# EAGLE design ridicideskaV2 (EAGLE 6.3)

## Sheet 1 of 3: Pro sensory vlhkosti
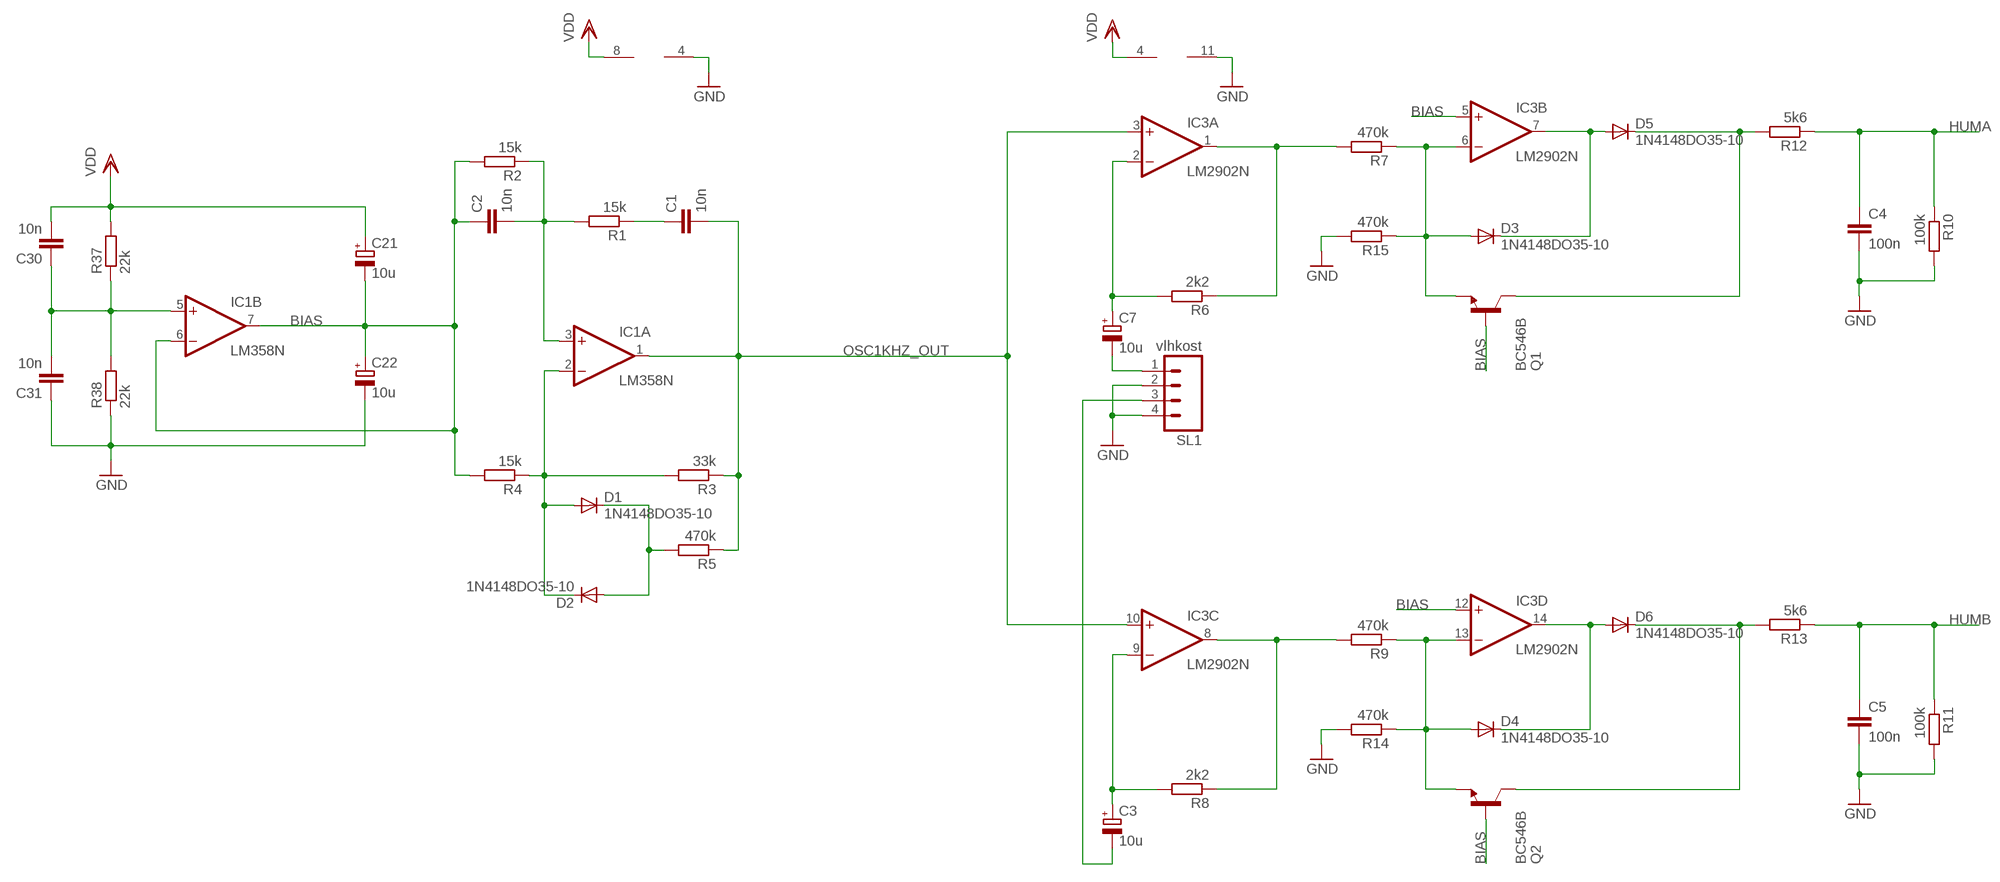
[diagram p0: schematic, sheet 1]

### Parts
C1  10n  C-EUC0805  [C0805]
C2  10n  C-EUC0805  [C0805]
C3  10u  CPOL-EUE3.5-8  [E3,5-8]
C4  100n  C-EUC0805  [C0805]
C5  100n  C-EUC0805  [C0805]
C7  10u  CPOL-EUE3.5-8  [E3,5-8]
C21  10u  CPOL-EUE3.5-8  [E3,5-8]
C22  10u  CPOL-EUE3.5-8  [E3,5-8]
C30  10n  C-EUC0805  [C0805]
C31  10n  C-EUC0805  [C0805]
D1  1N4148DO35-10  [DO35-10]
D2  1N4148DO35-10  [DO35-10]
D3  1N4148DO35-10  [DO35-10]
D4  1N4148DO35-10  [DO35-10]
D5  1N4148DO35-10  [DO35-10]
D6  1N4148DO35-10  [DO35-10]
IC1  LM358N  [DIL08]
IC3  LM2902N  [DIL14]
Q1  BC546B  [TO92-EBC]
Q2  BC546B  [TO92-EBC]
R1  15k  R-EU_R0805  [R0805]
R2  15k  R-EU_R0805  [R0805]
R3  33k  R-EU_R0805  [R0805]
R4  15k  R-EU_R0805  [R0805]
R5  470k  R-EU_R0805  [R0805]
R6  2k2  R-EU_R0805  [R0805]
R7  470k  R-EU_R0805  [R0805]
R8  2k2  R-EU_R0805  [R0805]
R9  470k  R-EU_R0805  [R0805]
R10  100k  R-EU_R0805  [R0805]
R11  100k  R-EU_R0805  [R0805]
R12  5k6  R-EU_R0805  [R0805]
R13  5k6  R-EU_R0805  [R0805]
R14  470k  R-EU_R0805  [R0805]
R15  470k  R-EU_R0805  [R0805]
R37  22k  R-EU_0207/12  [0207/12]
R38  22k  R-EU_0207/12  [0207/12]
SL1  vlhkost  M04  [04P]

### Nets
BIAS: C2.1 C21.- C22.+ IC1.6(B:-IN) IC1.7(B:OUT) IC3.5(B:+IN) IC3.12(D:+IN) Q1.B Q2.B R2.2 R4.2
GND: C4.2 C5.2 C22.- C31.1 IC1.4(P:V-) IC3.11(P:V-) R10.2 R11.2 R14.2 R15.2 R38.1 SL1.2 SL1.4 ; also sheet 2,3
HUMA: C4.1 R10.1 R12.1 ; also sheet 2
HUMB: C5.1 R11.1 R13.1 ; also sheet 2
N$1: IC3.1(A:OUT) R6.1 R7.2
N$2: C1.1 R1.1
N$3: C2.2 IC1.3(A:+IN) R1.2 R2.1
N$4: C7.+ IC3.2(A:-IN) R6.2
N$5: D1.A D2.C IC1.2(A:-IN) R3.2 R4.1
N$6: C7.- SL1.1
N$7: D1.C D2.A R5.2
N$8: D3.A IC3.6(B:-IN) Q1.E R7.1 R15.1
N$9: D5.C Q1.C R12.2
N$10: D3.C D5.A IC3.7(B:OUT)
N$11: IC3.8(C:OUT) R8.1 R9.2
N$12: C3.+ IC3.9(C:-IN) R8.2
N$13: C3.- SL1.3
N$15: D4.A IC3.13(D:-IN) Q2.E R9.1 R14.1
N$16: D4.C D6.A IC3.14(D:OUT)
N$17: D6.C Q2.C R13.2
N$82: C30.1 C31.2 IC1.5(B:+IN) R37.1 R38.2
OSC1KHZ_OUT: C1.2 IC1.1(A:OUT) IC3.3(A:+IN) IC3.10(C:+IN) R3.1 R5.1
VDD: C21.+ C30.2 IC1.8(P:V+) IC3.4(P:V+) R37.2 ; also sheet 2,3

## Sheet 2 of 3
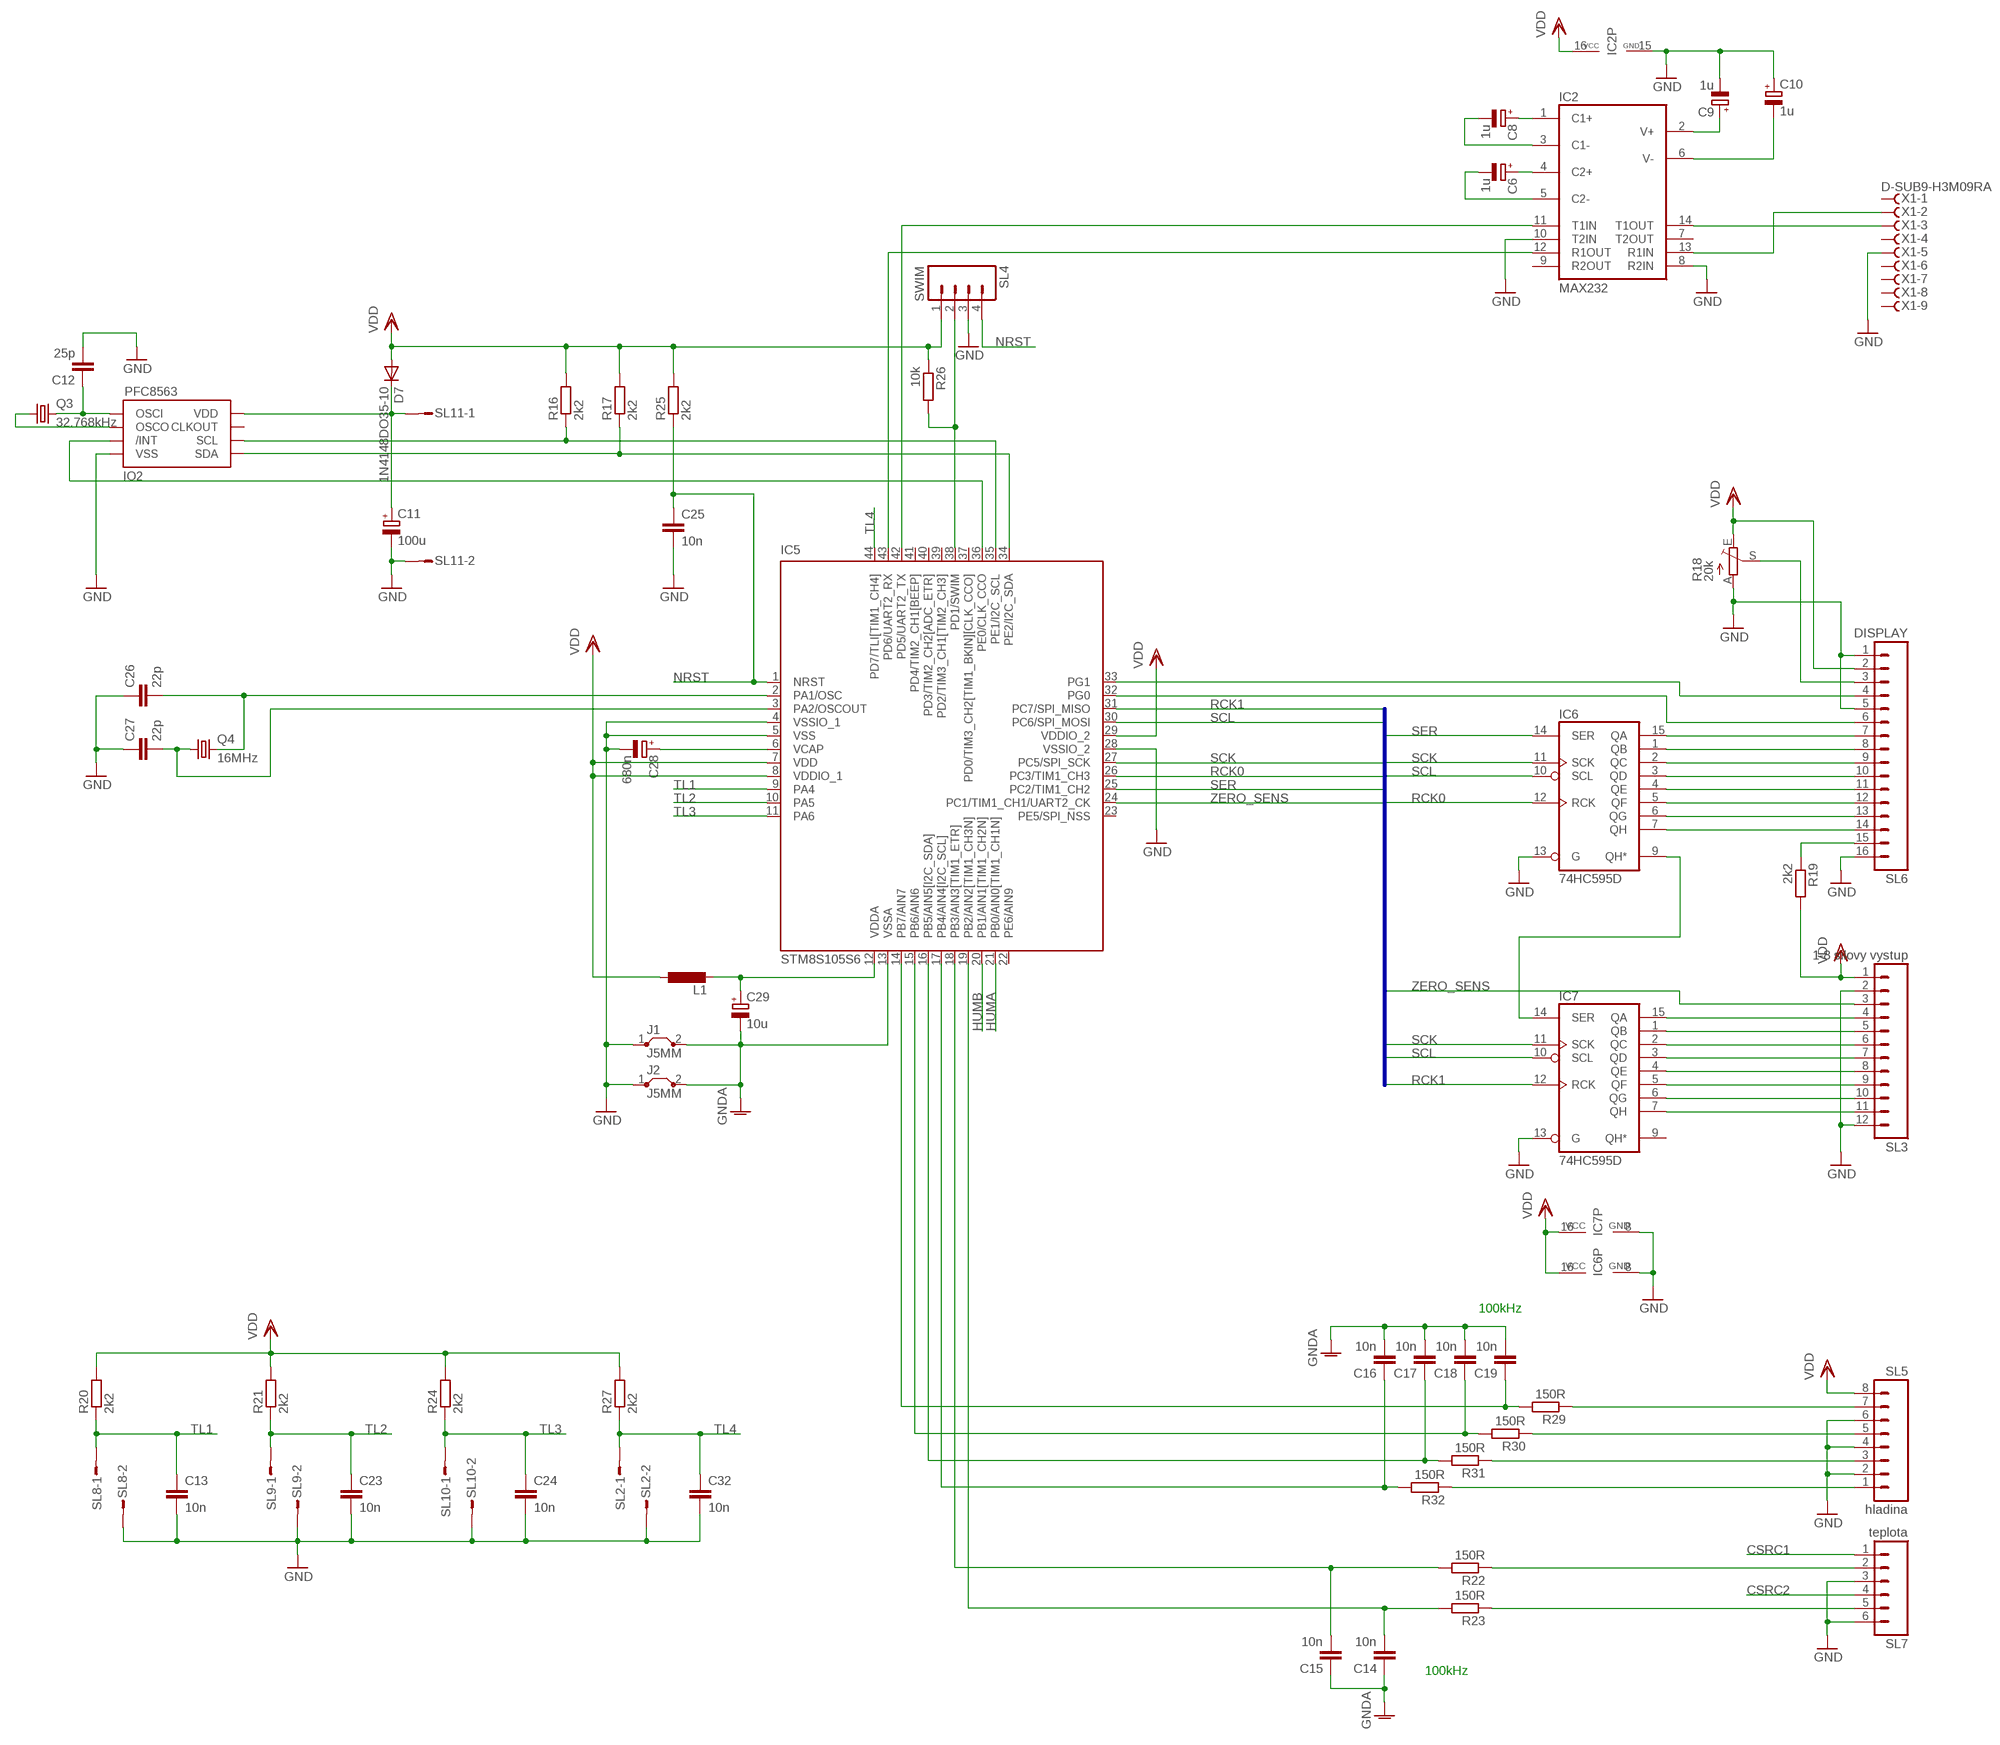
[diagram p1: schematic, sheet 2]

### Parts
C6  1u  CPOL-EUE3.5-8  [E3,5-8]
C8  1u  CPOL-EUE3.5-8  [E3,5-8]
C9  1u  CPOL-EUE3.5-8  [E3,5-8]
C10  1u  CPOL-EUE3.5-8  [E3,5-8]
C11  100u  CPOL-EUE5-10.5  [E5-10,5]
C12  25p  C-EUC0805  [C0805]
C13  10n  C-EUC0805  [C0805]
C14  10n  C-EUC0805  [C0805]
C15  10n  C-EUC0805  [C0805]
C16  10n  C-EUC0805  [C0805]
C17  10n  C-EUC0805  [C0805]
C18  10n  C-EUC0805  [C0805]
C19  10n  C-EUC0805  [C0805]
C23  10n  C-EUC0805  [C0805]
C24  10n  C-EUC0805  [C0805]
C25  10n  C-EUC0805  [C0805]
C26  22p  C-EUC0805  [C0805]
C27  22p  C-EUC0805  [C0805]
C28  680n  CPOL-EUSMCB  [SMC_B]
C29  10u  CPOL-EUE5-10.5  [E5-10,5]
C32  10n  C-EUC0805  [C0805]
D7  1N4148DO35-10  [DO35-10]
IC2  MAX232  [DIL16]
IC5  STM8S105S6  [LQFP44-10X10]
IC6  74HC595D  [SO16]
IC7  74HC595D  [SO16]
IO2  PFC8563  [SO08]
J1  J5MM  [05]
J2  J5MM  [05]
L1  L-EU0207/12  [0207/12]
Q3  32.768kHz  CRYSTALHC49U70  [HC49U70]
Q4  16MHz  CRYSTALHC49U-V  [HC49U-V]
R16  2k2  R-EU_0207/12  [0207/12@1]
R17  2k2  R-EU_0207/12  [0207/12@1]
R18  20k  TRIM_EU-CA6V  [CA6V]
R19  2k2  R-EU_0207/12  [0207/12@1]
R20  2k2  R-EU_0207/12  [0207/12@1]
R21  2k2  R-EU_0207/12  [0207/12@1]
R22  150R  R-EU_R0805  [R0805]
R23  150R  R-EU_R0805  [R0805]
R24  2k2  R-EU_0207/12  [0207/12@1]
R25  2k2  R-EU_0207/12  [0207/12@1]
R26  10k  R-EU_R0805  [R0805]
R27  2k2  R-EU_0207/12  [0207/12@1]
R29  150R  R-EU_R0805  [R0805]
R30  150R  R-EU_R0805  [R0805]
R31  150R  R-EU_R0805  [R0805]
R32  150R  R-EU_R0805  [R0805]
SL2  M02S  [02P]
SL3  1-8 silovy vystup  M12  [12P]
SL4  SWIM  M04  [04P]
SL5  hladina  M08  [08P]
SL6  DISPLAY  M16  [16P]
SL7  teplota  M06  [06P]
SL8  M02S  [02P]
SL9  M02S  [02P]
SL10  M02S  [02P]
SL11  M02S  [02P]
X1  D-SUB9-H3M09RA  [H3M09RA]

### Nets
CSRC1: SL7.1 ; also sheet 3
CSRC2: SL7.4 ; also sheet 3
GND: C9.- C10.+ C11.- C12.2 C13.2 C23.2 C24.2 C25.2 C26.1 C27.1 C28.- C32.2 IC2.8(R2IN) IC2.10(T2IN) IC2.15(GND) IC5.4(VSSIO_1) IC5.5(VSS) IC5.28(VSSIO_2) IC6.8(GND) IC6.13(G) IC7.8(GND) IC7.13(G) IO2.4(VSS) J1.1 J2.1 R18.A SL2.2 SL3.2 SL3.12 SL4.3 SL5.2 SL5.4 SL5.6 SL6.1 SL6.5 SL6.16 SL7.3 SL7.6 SL8.2 SL9.2 SL10.2 SL11.2 X1.5 ; also sheet 1,3
GNDA: C14.1 C15.1 C16.2 C17.2 C18.2 C19.2 C29.- IC5.13(VSSA) J1.2 J2.2
HUMA: IC5.21(PB0/AIN0[TIM1_CH1N]) ; also sheet 1
HUMB: IC5.20(PB1/AIN1[TIM1_CH2N]) ; also sheet 1
N$14: IC2.12(R1OUT) IC5.43(PD6/UART2_RX)
N$18: IC2.11(T1IN) IC5.42(PD5/UART2_TX)
N$19: IC2.14(T1OUT) X1.3
N$20: IC2.13(R1IN) X1.2
N$21: C9.+ IC2.2(V+)
N$22: C10.- IC2.6(V-)
N$23: IC5.34(PE2/I2C_SDA) IO2.5(SDA) R17.1
N$24: C8.- IC2.3(C1-)
N$25: C8.+ IC2.1(C1+)
N$26: C6.+ IC2.4(C2+)
N$27: C6.- IC2.5(C2-)
N$28: IC5.35(PE1/I2C_SCL) IO2.6(SCL) R16.1
N$29: C11.+ D7.C IO2.8(VDD) SL11.1
N$30: IC5.36(PE0/CLK_CCO) IO2.3(/INT)
N$31: R18.S SL6.3
N$32: R19.1 SL6.15
N$33: IC7.5(QF) SL3.9
N$34: IC7.6(QG) SL3.10
N$35: IC7.7(QH) SL3.11
N$36: R23.1 SL7.5
N$37: C15.2 IC5.18(PB3/AIN3[TIM1_ETR]) R22.2
N$38: C27.2 IC5.3(PA2/OSCOUT) Q4.1
N$39: C12.1 IO2.1(OSCI) Q3.2
N$40: IO2.2(OSCO) Q3.1
N$41: IC6.7(QH) SL6.14
N$42: C26.2 IC5.2(PA1/OSC) Q4.2
N$43: IC6.6(QG) SL6.13
N$44: IC6.5(QF) SL6.12
N$45: R22.1 SL7.2
N$46: IC6.4(QE) SL6.11
N$47: C14.2 IC5.19(PB2/AIN2[TIM1_CH3N]) R23.2
N$48: C28.+ IC5.6(VCAP)
N$49: IC5.38(PD1/SWIM) R26.2 SL4.2
N$50: IC7.15(QA) SL3.4
N$51: IC7.1(QB) SL3.5
N$52: C29.+ IC5.12(VDDA) L1.2
N$53: C16.1 IC5.17(PB4/AIN4[I2C_SCL]) R32.2
N$54: C17.1 IC5.16(PB5/AIN5[I2C_SDA]) R31.2
N$55: C18.1 IC5.15(PB6/AIN6) R30.2
N$56: C19.1 IC5.14(PB7/AIN7) R29.2
N$57: R29.1 SL5.7
N$58: R30.1 SL5.5
N$59: R31.1 SL5.3
N$60: R32.1 SL5.1
N$65: IC6.3(QD) SL6.10
N$66: IC6.2(QC) SL6.9
N$67: IC6.1(QB) SL6.8
N$68: IC6.15(QA) SL6.7
N$71: IC5.32(PG0) SL6.6
N$73: IC5.33(PG1) SL6.4
N$76: IC6.9(QH*) IC7.14(SER)
N$78: IC7.2(QC) SL3.6
N$79: IC7.3(QD) SL3.7
N$80: IC7.4(QE) SL3.8
NRST: C25.1 IC5.1(NRST) R25.1 SL4.4
RCK0: IC5.26(PC3/TIM1_CH3) IC6.12(RCK)
RCK1: IC5.31(PC7/SPI_MISO) IC7.12(RCK)
SCK: IC5.27(PC5/SPI_SCK) IC6.11(SCK) IC7.11(SCK)
SCL: IC5.30(PC6/SPI_MOSI) IC6.10(SCL) IC7.10(SCL)
SER: IC5.25(PC2/TIM1_CH2) IC6.14(SER)
TL1: C13.1 IC5.9(PA4) R20.1 SL8.1
TL2: C23.1 IC5.10(PA5) R21.1 SL9.1
TL3: C24.1 IC5.11(PA6) R24.1 SL10.1
TL4: C32.1 IC5.44(PD7/TLI[TIM1_CH4]) R27.1 SL2.1
VDD: D7.A IC2.16(VCC) IC5.7(VDD) IC5.8(VDDIO_1) IC5.29(VDDIO_2) IC6.16(VCC) IC7.16(VCC) L1.1 R16.2 R17.2 R18.E R19.2 R20.2 R21.2 R24.2 R25.2 R26.1 R27.2 SL3.1 SL4.1 SL5.8 SL6.2 ; also sheet 1,3
ZERO_SENS: IC5.24(PC1/TIM1_CH1/UART2_CK) SL3.3
Unconnected: IC2.7(T2OUT) IC2.9(R2OUT) IC5.22(PE6/AIN9) IC5.23(PE5/SPI_NSS) IC5.37(PD0/TIM3_CH2[TIM1_BKIN][CLK_CCO]) IC5.39(PD2/TIM3_CH1[TIM2_CH3]) IC5.40(PD3/TIM2_CH2[ADC_ETR]) IC5.41(PD4/TIM2_CH1[BEEP]) IC7.9(QH*) IO2.7(CLKOUT) X1.1 X1.4 X1.6 X1.7 X1.8 X1.9

### Buses
SER,SCK,SCL,RCK0,RCK1,ZERO_SENS

### Notes on the sheet
- 100kHz
- 100kHz

## Sheet 3 of 3
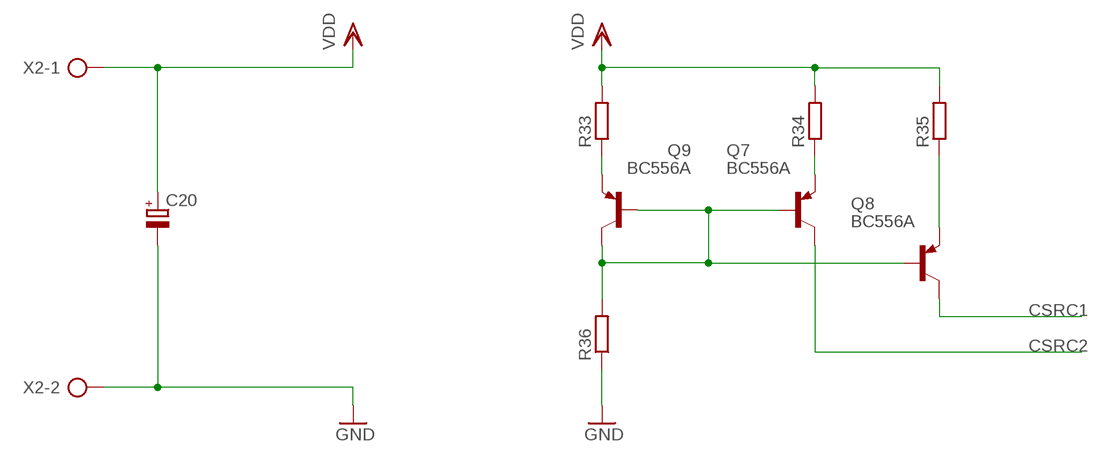
[diagram p2: schematic, sheet 3]

### Parts
C20  CPOL-EUE5-10.5  [E5-10,5]
Q7  BC556A  [TO92-EBC]
Q8  BC556A  [TO92-EBC]
Q9  BC556A  [TO92-EBC]
R33  R-EU_R0805  [R0805]
R34  R-EU_R0805  [R0805]
R35  R-EU_R0805  [R0805]
R36  R-EU_R0805  [R0805]
X2  AK300/2  [AK300/2]

### Nets
CSRC1: Q8.C ; also sheet 2
CSRC2: Q7.C ; also sheet 2
GND: C20.- R36.1 X2.2 ; also sheet 1,2
N$61: Q7.B Q8.B Q9.B Q9.C R36.2
N$62: Q7.E R34.1
N$63: Q8.E R35.1
N$64: Q9.E R33.1
VDD: C20.+ R33.2 R34.2 R35.2 X2.1 ; also sheet 1,2

## Library data of the parts
C1 C2 C4 C5 C12-C19 C23-C27 C30-C32 = rcl:C-EU: CAPACITOR, European symbol
C3 C7 C28 = rcl:CPOL-EU: POLARIZED CAPACITOR, European symbol
C6 C8-C11 C20-C22 C29 = resistor:CPOL-EU: POLARIZED CAPACITOR, European symbol
D1-D7 = diode:1N4148: DIODE high speed (Philips)
IC1 = linear:LM358: OP AMP also LM158; LM258; LM2904 Source: http://cache.national.com/ds/LM/LM158.pdf
IC2 = maxim:MAX232: RS232 TRANSEIVER; MF: MAXIM; MPN: MAX232ACPE+; OC_FARNELL: 9723773; OC_NEWARK: 68K4544
IC3 = linear:LM2902: Low power quad operational amplifier Source: Data sgeet
IC5 = st-microelectronics:STM8S105S: Access line, 16 MHz STM8S 8-bit MCU up to 32 Kbytes Flash, integrated EEPROM,10-bit ADC, timers, UART, SPI, I²C Source: Data sheet; MPN: STM8S105S6T6C; OC_FARNELL: 1706228; OC_NEWARK: 09R6038
IC6 IC7 = 74xx-eu:74*595: 8-bit SHIFT REGISTER, output latch
IO2 = atypPouzdra:PFC8563
J1 J2 = jumper:J: Bridge
L1 = rcl:L-EU: INDUCTOR, European symbol
Q1 Q2 = transistor-npn:BC546*: NPN Transistor
Q3 = crystal:CRYSTAL: CRYSTAL; OC_FARNELL: unknown; OC_NEWARK: unknown
Q4 = crystal:CRYSTAL: CRYSTAL; OC_FARNELL: 1666969; OC_NEWARK: unknown
Q7-Q9 = transistor-pnp:BC556*: PNP Transistror
R1-R17 R19-R27 R29-R36 = rcl:R-EU_: RESISTOR, European symbol
R18 = pot:TRIM_EU-: POTENTIOMETER
R37 R38 = resistor:R-EU_: RESISTOR, European symbol
SL1 SL4 = con-amp-quick:M04: AMP QUICK CONNECTOR; OC_FARNELL: unknown; OC_NEWARK: unknown
SL2 SL8-SL11 = con-amp-quick:M02S: AMP QUICK CONNECTOR; OC_FARNELL: unknown; OC_NEWARK: unknown
SL3 = con-amp-quick:M12: AMP QUICK CONNECTOR; OC_FARNELL: unknown; OC_NEWARK: unknown
SL5 = con-amp-quick:M08: AMP QUICK CONNECTOR; OC_FARNELL: unknown; OC_NEWARK: unknown
SL6 = con-amp-quick:M16: AMP QUICK CONNECTOR; OC_FARNELL: unknown; OC_NEWARK: unknown
SL7 = con-amp-quick:M06: AMP QUICK CONNECTOR; OC_FARNELL: unknown; OC_NEWARK: unknown
X1 = con-thomas-betts:D-SUB9-: D-Subminiatur Connector Source: Electronioc Interconnects European Edition 1998; OC_FARNELL: unknown; OC_NEWARK: unknown
X2 = con-ptr500:AK300/2: CONNECTOR; OC_FARNELL: unknown; OC_NEWARK: unknown

## Board
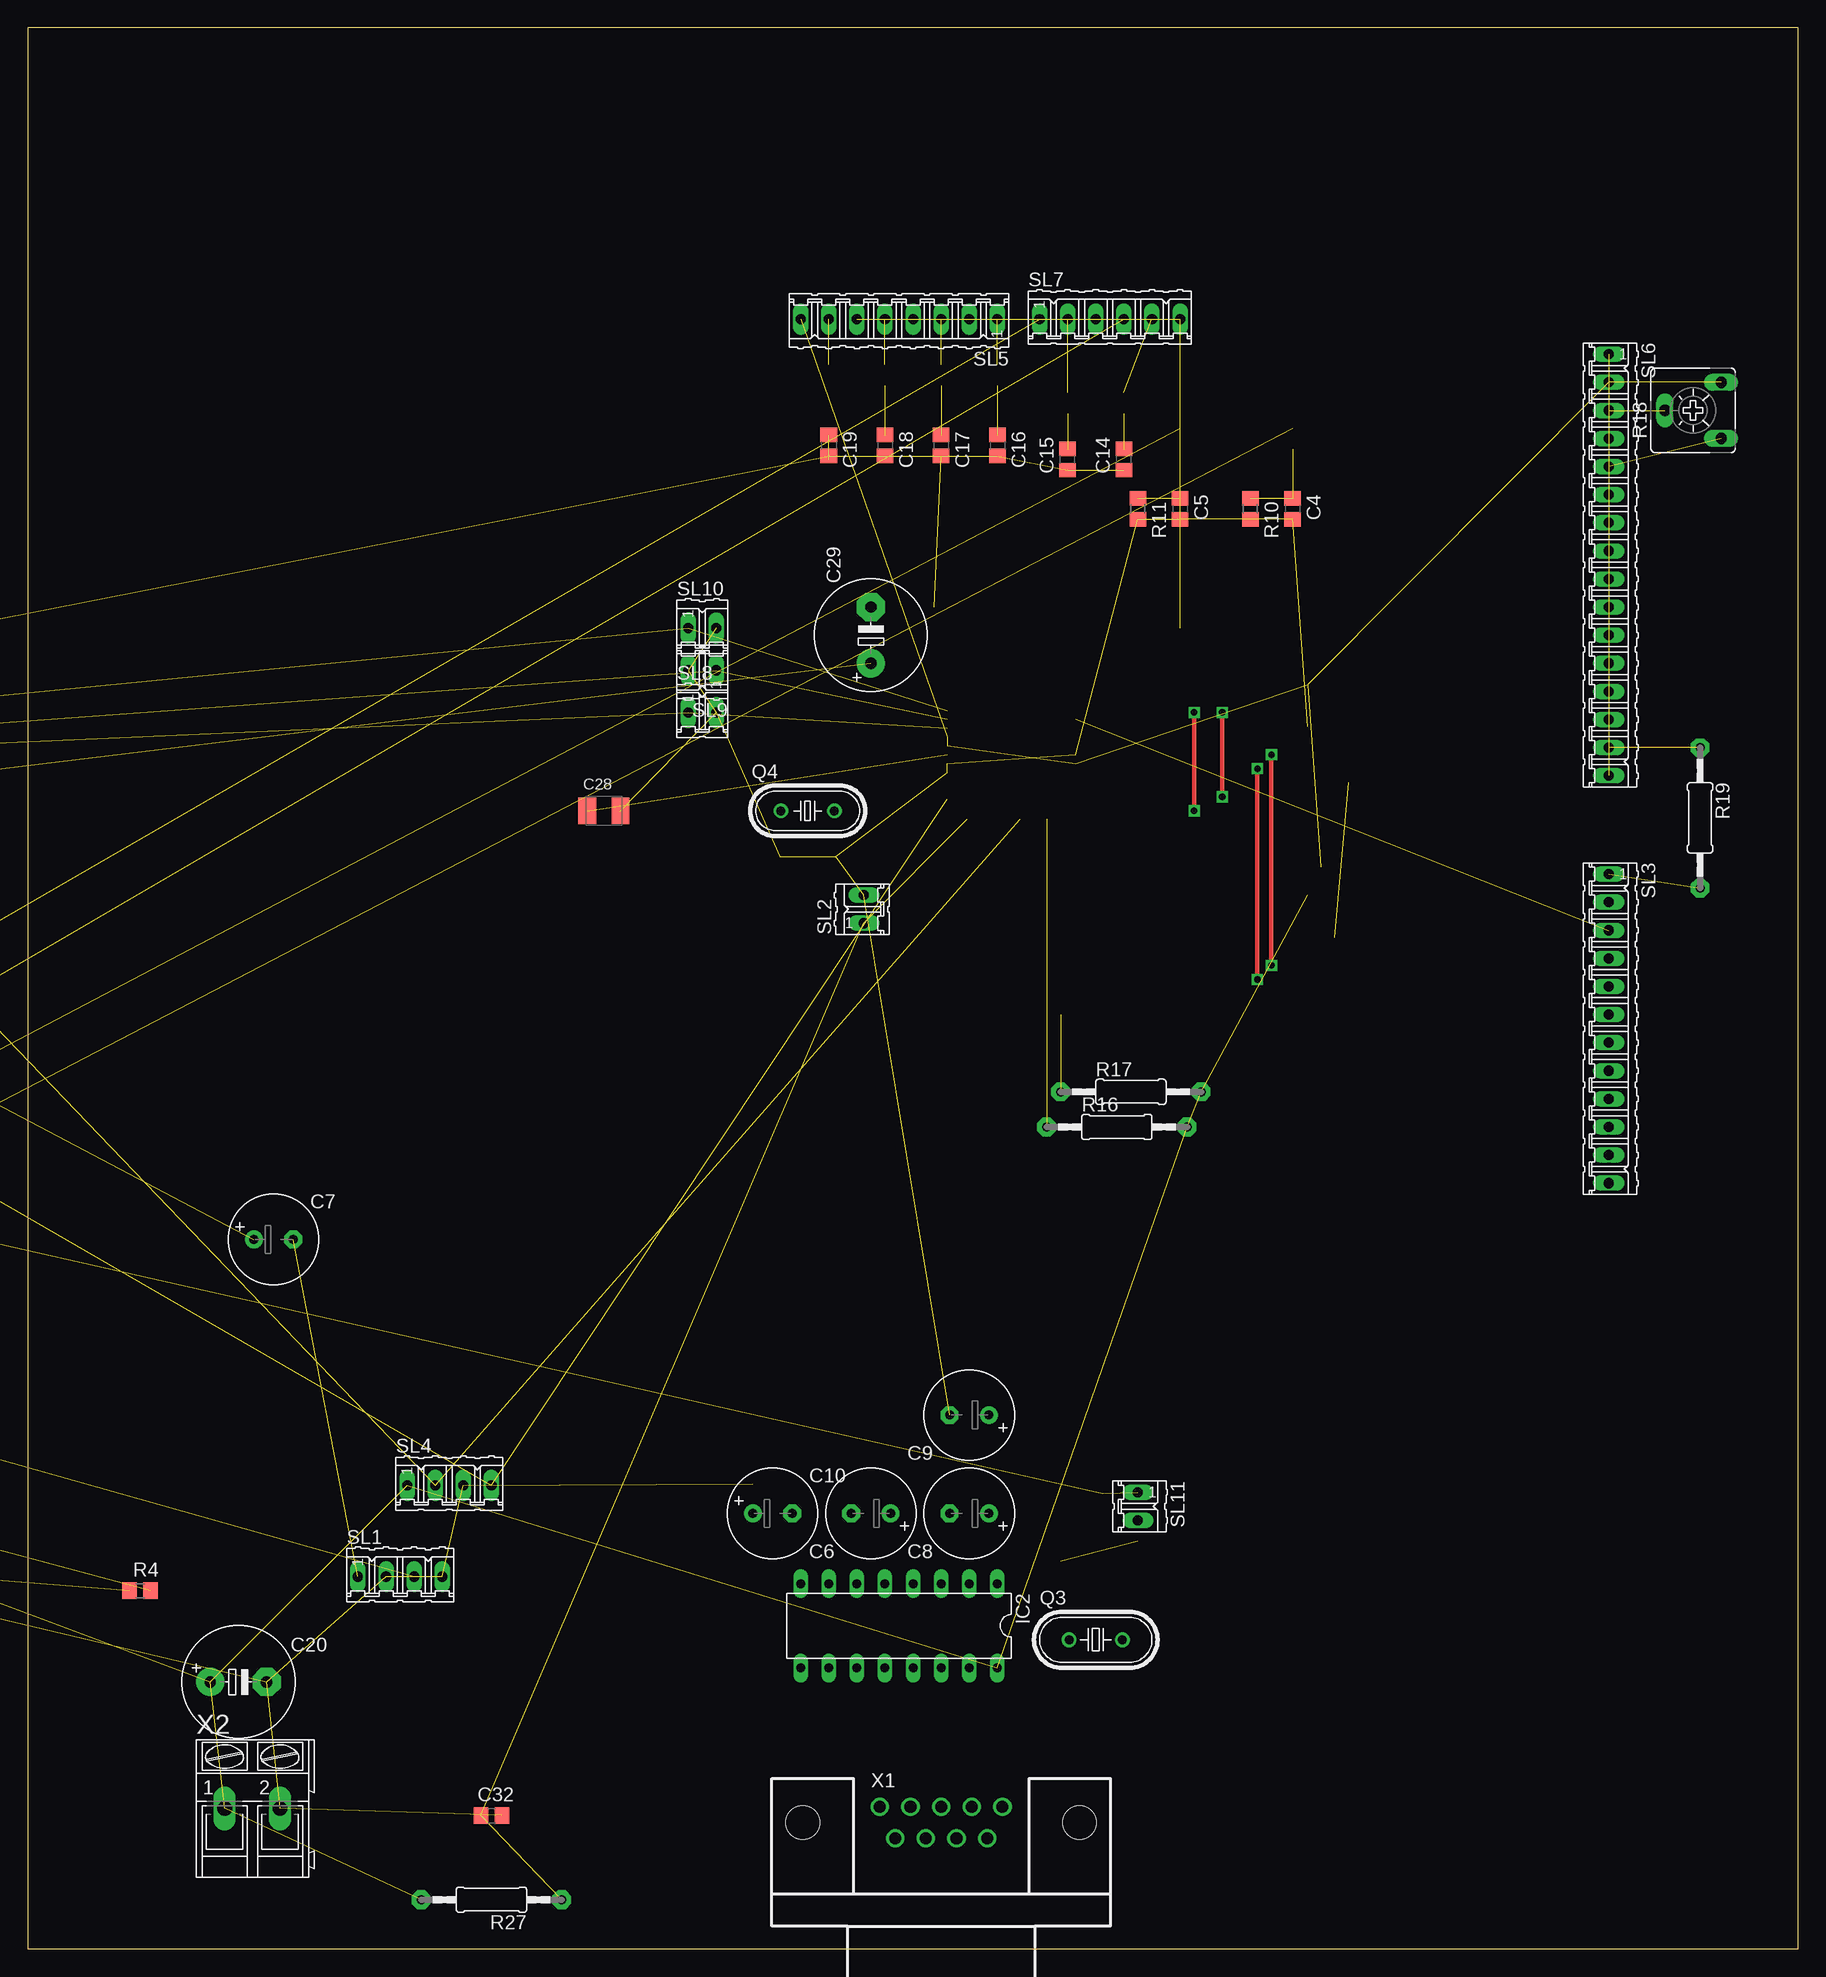
[diagram p3: board, top side]
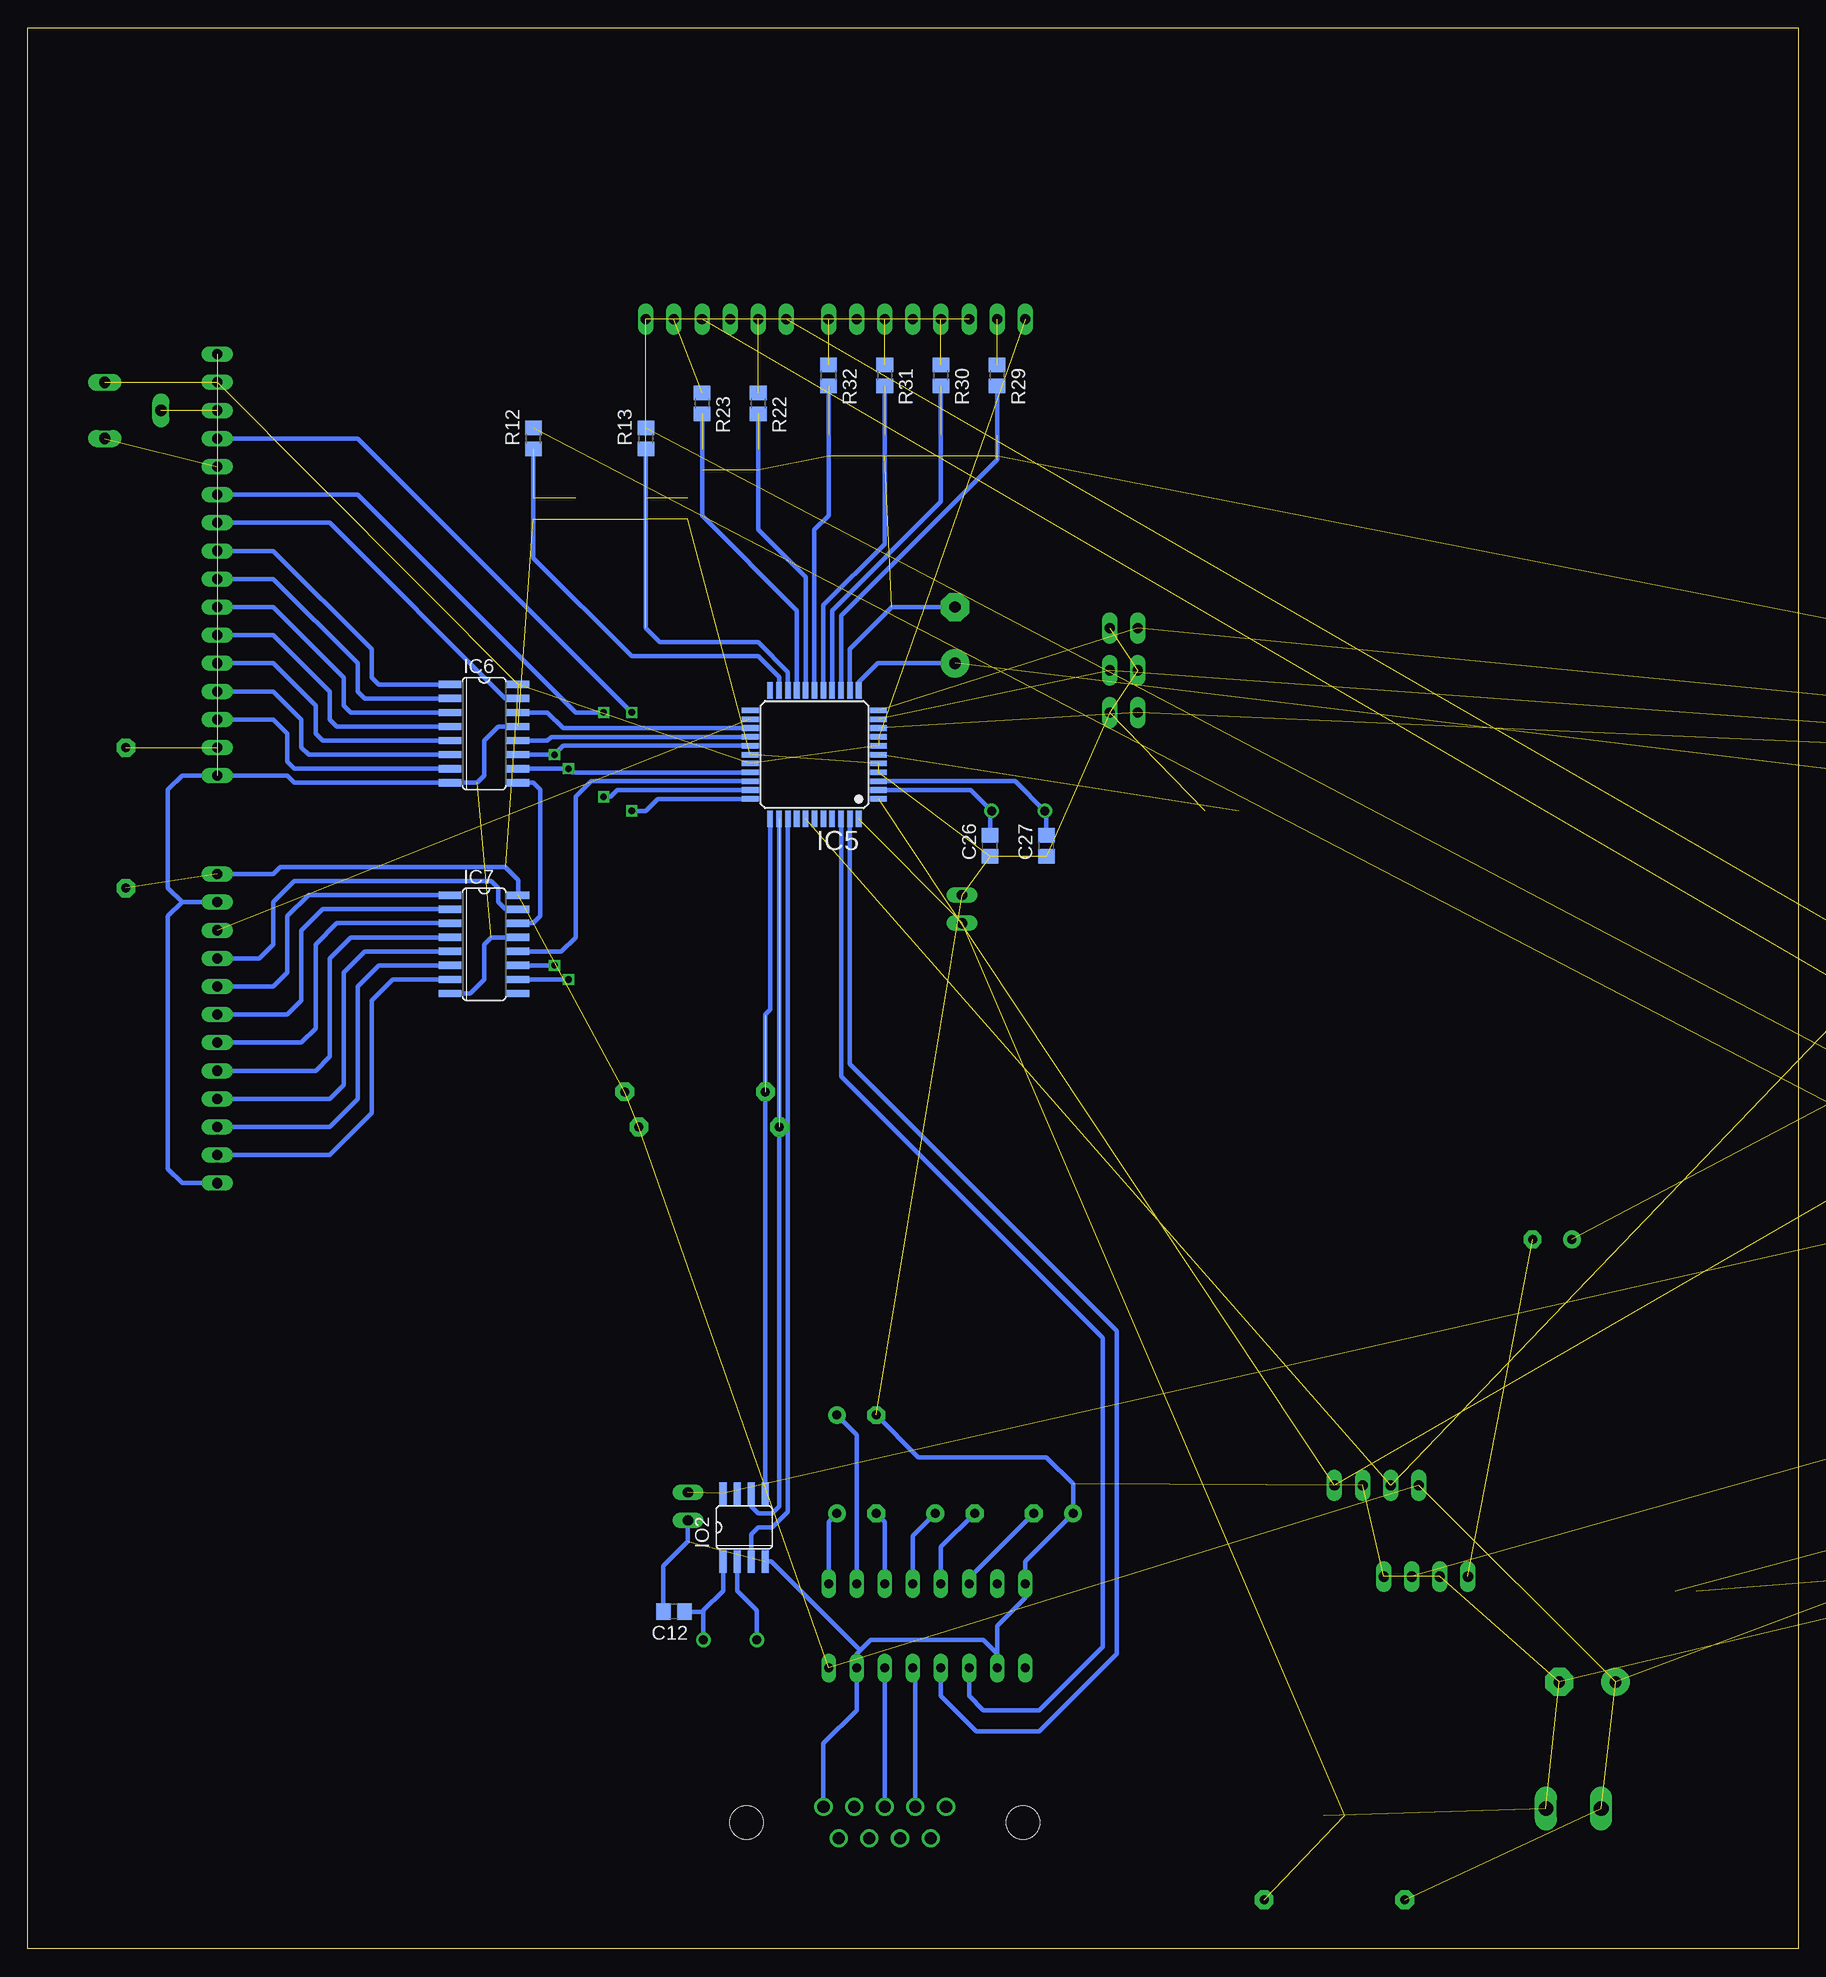
[diagram p4: board, bottom side, seen from below]

Size 160 x 173.66 mm. Coordinates in mm from the lower left corner, seen from the top.
Outline: 0,0 160,0 160,173.66 0,173.66 0,0
Copper layers (1*16): Top 0.035mm / dielectric 1.5mm / Bottom 0.035mm
Design rules "default": minimum track width 10mil, minimum drill 24mil, track to track 8mil, track to pad 8mil, pad to pad 8mil, via to via 8mil, smd to smd 8mil, copper to edge 40mil, drill to drill 8mil, minimum pad ring 10mil, minimum via ring 8mil, stop-mask expansion 4mil, vias tented up to drill 0mil, thermal gap 10mil

### Footprints (pad centres in the part's own frame; a part is rotated, then mirrored left to right if it is on the bottom)
C0805 = smd 1.3 x 1.5: 1 -0.95,0; 2 0.95,0
E3,5-8 = drill 0.813 pad 1.6: + -1.778,0 | drill 0.813 pad 1.6 octagon: - 1.778,0
E5-10,5 = drill 1.016 pad 2.54: + -2.54,0 | drill 1.016 pad 2.54 octagon: - 2.54,0
SMC_B = smd 1.6 x 2.4: + -1.5,0; - 1.5,0
DO35-10 = drill 0.813 long: A 5.08,0; C -5.08,0
DIL08 = drill 0.813 pad 1.27: 1 -3.81,-3.81; 2 -1.27,-3.81; 3 1.27,-3.81; 4 3.81,-3.81; 5 3.81,3.81; 6 1.27,3.81; 7 -1.27,3.81; 8 -3.81,3.81
DIL16 = drill 0.813 long: 1 -8.89,-3.81; 2 -6.35,-3.81; 3 -3.81,-3.81; 4 -1.27,-3.81; 5 1.27,-3.81; 6 3.81,-3.81; 7 6.35,-3.81; 8 8.89,-3.81; 9 8.89,3.81; 10 6.35,3.81; 11 3.81,3.81; 12 1.27,3.81; 13 -1.27,3.81; 14 -3.81,3.81; 15 -6.35,3.81; 16 -8.89,3.81
DIL14 = drill 0.813 long: 1 -7.62,-3.81; 2 -5.08,-3.81; 3 -2.54,-3.81; 4 0,-3.81; 5 2.54,-3.81; 6 5.08,-3.81; 7 7.62,-3.81; 8 7.62,3.81; 9 5.08,3.81; 10 2.54,3.81; 11 0,3.81; 12 -2.54,3.81; 13 -5.08,3.81; 14 -7.62,3.81
LQFP44-10X10 = smd 1.5 x 0.5: 1 -5.8,4; 2 -5.8,3.2; 3 -5.8,2.4; 4 -5.8,1.6; 5 -5.8,0.8; 6 -5.8,0; 7 -5.8,-0.8; 8 -5.8,-1.6; 9 -5.8,-2.4; 10 -5.8,-3.2; 11 -5.8,-4; 23 5.8,-4; 24 5.8,-3.2; 25 5.8,-2.4; 26 5.8,-1.6; 27 5.8,-0.8; 28 5.8,0; 29 5.8,0.8; 30 5.8,1.6; 31 5.8,2.4; 32 5.8,3.2; 33 5.8,4 | smd 0.5 x 1.5: 12 -4,-5.8; 13 -3.2,-5.8; 14 -2.4,-5.8; 15 -1.6,-5.8; 16 -0.8,-5.8; 17 0,-5.8; 18 0.8,-5.8; 19 1.6,-5.8; 20 2.4,-5.8; 21 3.2,-5.8; 22 4,-5.8; 34 4,5.8; 35 3.2,5.8; 36 2.4,5.8; 37 1.6,5.8; 38 0.8,5.8; 39 0,5.8; 40 -0.8,5.8; 41 -1.6,5.8; 42 -2.4,5.8; 43 -3.2,5.8; 44 -4,5.8
SO16 = smd 0.66 x 2.032: 1 -4.445,-3.073; 2 -3.175,-3.073; 3 -1.905,-3.073; 4 -0.635,-3.073; 5 0.635,-3.073; 6 1.905,-3.073; 7 3.175,-3.073; 8 4.445,-3.073; 9 4.445,3.073; 10 3.175,3.073; 11 1.905,3.073; 12 0.635,3.073; 13 -0.635,3.073; 14 -1.905,3.073; 15 -3.175,3.073; 16 -4.445,3.073
SO08 = smd 0.66 x 2.032: 1 -1.905,-3.073; 2 -0.635,-3.073; 3 0.635,-3.073; 4 1.905,-3.073; 5 1.905,3.073; 6 0.635,3.073; 7 -0.635,3.073; 8 -1.905,3.073
05 = drill 0.813 pad 1.6 octagon: 1 -2.54,0; 2 2.54,0
0207/12 = drill 0.813 octagon: 1 -6.35,0; 2 6.35,0
TO92-EBC = drill 0.813 long: B 0,-1.27; C -2.54,-1.27; E 2.54,-1.27
HC49U70 = drill 0.813: 1 -2.413,0; 2 2.413,0
HC49U-V = drill 0.813: 1 -2.413,0; 2 2.413,0
R0805 = smd 1.3 x 1.5: 1 -0.95,0; 2 0.95,0
0207/12@1 = drill 0.813 pad 1.676 octagon: 1 -6.35,0; 2 6.35,0
CA6V = drill 1.016 long: A -2.54,-2.54; E 2.54,-2.54; S 0,2.54
04P = drill 0.914 long: 1 -3.81,0; 2 -1.27,0; 3 1.27,0; 4 3.81,0
02P = drill 0.914 long: 1 -1.27,0; 2 1.27,0
12P = drill 0.914 long: 1 -13.97,0; 2 -11.43,0; 3 -8.89,0; 4 -6.35,0; 5 -3.81,0; 6 -1.27,0; 7 1.27,0; 8 3.81,0; 9 6.35,0; 10 8.89,0; 11 11.43,0; 12 13.97,0
08P = drill 0.914 long: 1 -8.89,0; 2 -6.35,0; 3 -3.81,0; 4 -1.27,0; 5 1.27,0; 6 3.81,0; 7 6.35,0; 8 8.89,0
16P = drill 0.914 long: 1 -19.05,0; 2 -16.51,0; 3 -13.97,0; 4 -11.43,0; 5 -8.89,0; 6 -6.35,0; 7 -3.81,0; 8 -1.27,0; 9 1.27,0; 10 3.81,0; 11 6.35,0; 12 8.89,0; 13 11.43,0; 14 13.97,0; 15 16.51,0; 16 19.05,0
06P = drill 0.914 long: 1 -6.35,0; 2 -3.81,0; 3 -1.27,0; 4 1.27,0; 5 3.81,0; 6 6.35,0
H3M09RA = drill 1.092: 1 -5.537,1.422; 2 -2.769,1.422; 3 0,1.422; 4 2.769,1.422; 5 5.537,1.422; 6 -4.153,-1.422; 7 -1.384,-1.422; 8 1.384,-1.422; 9 4.153,-1.422 | hole 3.048: -12.497,0; 12.497,0
AK300/2 = drill 1.321 long: 1 -2.515,0; 2 2.489,0

### Placement (x,y rotation side)
C1  not placed on the board
C2  not placed on the board
C3  not placed on the board
C4  114.3,130.18 270 top
C5  104.14,130.18 270 top
C6  76.2,39.37 180 top
C7  22.23,64.14 0 top
C8  85.09,39.37 180 top
C9  85.09,48.26 180 top
C10  67.31,39.37 0 top
C11  not placed on the board
C12  101.6,30.48 180 bottom
C13  not placed on the board
C14  99.06,134.62 90 top
C15  93.98,134.62 90 top
C16  87.63,135.89 270 top
C17  82.55,135.89 270 top
C18  77.47,135.89 270 top
C19  72.39,135.89 270 top
C20  19.05,24.13 0 top
C21  not placed on the board
C22  not placed on the board
C23  not placed on the board
C24  not placed on the board
C25  not placed on the board
C26  73.03,99.69 90 bottom
C27  67.94,99.69 90 bottom
C28  52.07,102.87 0 top
C29  76.2,118.75 90 top
C30  not placed on the board
C31  not placed on the board
C32  41.91,12.06 0 top
D1  not placed on the board
D2  not placed on the board
D3  not placed on the board
D4  not placed on the board
D5  not placed on the board
D6  not placed on the board
D7  not placed on the board
IC1  not placed on the board
IC2  78.74,29.21 180 top
IC3  not placed on the board
IC5  88.9,107.95 180 bottom
IC6  118.75,109.86 270 bottom
IC7  118.75,90.81 270 bottom
IO2  95.25,38.1 0 bottom
J1  not placed on the board
J2  not placed on the board
L1  not placed on the board
Q1  not placed on the board
Q2  not placed on the board
Q3  96.52,27.94 0 top
Q4  70.48,102.87 0 top
Q7  not placed on the board
Q8  not placed on the board
Q9  not placed on the board
R1  not placed on the board
R2  not placed on the board
R3  not placed on the board
R4  10.16,32.38 0 top
R5  not placed on the board
R6  not placed on the board
R7  not placed on the board
R8  not placed on the board
R9  not placed on the board
R10  110.49,130.18 270 top
R11  100.33,130.18 270 top
R12  114.3,136.53 90 bottom
R13  104.14,136.53 90 bottom
R14  not placed on the board
R15  not placed on the board
R16  98.42,74.3 0 top
R17  99.69,77.47 0 top
R18  150.5,139.06 90 top
R19  151.13,102.23 270 top
R20  not placed on the board
R21  not placed on the board
R22  93.98,139.7 270 bottom
R23  99.06,139.7 270 bottom
R24  not placed on the board
R25  not placed on the board
R26  not placed on the board
R27  41.91,4.45 180 top
R29  72.39,142.24 270 bottom
R30  77.47,142.24 270 bottom
R31  82.55,142.24 270 bottom
R32  87.63,142.24 270 bottom
R33  not placed on the board
R34  not placed on the board
R35  not placed on the board
R36  not placed on the board
R37  not placed on the board
R38  not placed on the board
SL1  33.66,33.66 0 top
SL2  75.56,93.98 90 top
SL3  142.88,83.19 270 top
SL4  38.1,41.91 0 top
SL5  78.74,147.32 180 top
SL6  142.88,125.09 270 top
SL7  97.79,147.32 0 top
SL8  60.96,111.76 0 top
SL9  60.96,115.57 180 top
SL10  60.96,119.38 0 top
SL11  100.33,40.01 270 top
X1  82.55,11.43 0 top
X2  20.32,12.7 0 top

### Tracks (layer width: path | path; a pad name or v marks a point on that pad's centre or on a via)
BIAS  (10 unrouted)
CSRC1  (1 unrouted)
CSRC2  (1 unrouted)
GND  (46 unrouted)
  Bottom 0.406: X1.5 88.09,18.59 85.09,21.59 IC2.15 85.09,26.67 84.77,26.99 | 84.77,26.99 83.82,27.94 73.66,27.94 72.39,26.67 IC2.10 72.39,29.21 69.85,31.75 IC2.8 69.85,35.05 C10.+ 65.53,42.04 67.94,44.45 79.5,44.45 C9.- | SL3.12 146.05,69.22 147.32,70.48 147.32,93.34 146.05,94.61 | 146.05,94.61 SL3.2 | 146.05,94.61 147.32,95.89 147.32,104.78 146.05,106.05 SL6.16 136.53,106.05 135.89,105.41 IC6.8 119.38,105.41 118.75,106.05 118.75,109.22 117.47,110.49 IC6.13 | IC7.8 120.02,86.36 118.75,87.63 118.75,90.81 118.11,91.44 IC7.13 | SL11.2 100.33,36.83 102.55,34.61 C12.2 | IO2.4 92.81,35.03 84.77,26.99
GNDA  (8 unrouted)
  Bottom 0.406: IC5.13 85.7,117.5 81.92,121.28 C29.-
HUMA  (2 unrouted)
  Bottom 0.406: IC5.21 92.1,114.96 93.98,116.84 105.41,116.84 114.3,125.73 R12.1
HUMB  (2 unrouted)
  Bottom 0.406: IC5.20 91.3,115.43 93.98,118.11 102.87,118.11 104.14,119.38 R13.1
N$1  (2 unrouted)
N$2  (1 unrouted)
N$3  (3 unrouted)
N$4  (2 unrouted)
N$5  (4 unrouted)
N$6  (1 unrouted)
N$7  (2 unrouted)
N$8  (4 unrouted)
N$9  (2 unrouted)
N$10  (2 unrouted)
N$11  (2 unrouted)
N$12  (2 unrouted)
N$13  (1 unrouted)
N$14
  Bottom 0.406: IC2.12 77.47,22.86 74.3,19.68 68.58,19.68 61.59,26.67 61.59,55.88 82.23,76.52 83.82,78.11 85.7,79.98 IC5.43
N$15  (4 unrouted)
N$16  (2 unrouted)
N$17  (2 unrouted)
N$18
  Bottom 0.406: IC2.11 74.93,22.86 73.66,21.59 68.58,21.59 62.87,27.3 62.87,55.24 86.5,78.88 IC5.42
N$19
  Bottom 0.406: X1.3 IC2.14
N$20
  Bottom 0.406: X1.2 79.78,25.17 IC2.13
N$21
  Bottom 0.406: IC2.2 85.09,46.48 C9.+
N$22
  Bottom 0.406: IC2.6 74.93,33.53 C10.-
N$23  (1 unrouted)
  Bottom 0.406: IO2.5 93.34,84.45 92.9,84.9 IC5.34
N$24
  Bottom 0.406: IC2.3 82.55,38.61 C8.-
N$25
  Bottom 0.406: IC2.1 87.63,38.61 C8.+
N$26
  Bottom 0.406: IC2.4 80.01,37.34 C6.+
N$27
  Bottom 0.406: IC2.5 77.47,36.32 C6.-
N$28  (1 unrouted)
  Bottom 0.406: IO2.6 94.61,40.01 93.98,39.37 92.71,39.37 92.08,40.01 92.08,102.12 IC5.35
N$29  (3 unrouted)
N$30
  Bottom 0.406: IO2.3 94.61,37.47 93.98,38.1 92.71,38.1 91.3,39.51 IC5.36
N$31  (1 unrouted)
N$32  (1 unrouted)
N$33
  Bottom 0.406: IC7.5 129.54,90.17 131.44,88.27 131.44,78.11 132.72,76.83 SL3.9
N$34
  Bottom 0.406: IC7.6 128.27,88.9 130.18,87 130.18,76.83 132.72,74.3 SL3.10
N$35
  Bottom 0.406: IC7.7 127,87.63 128.91,85.72 128.91,75.56 132.72,71.75 SL3.11
N$36  (1 unrouted)
N$37  (1 unrouted)
  Bottom 0.406: IC5.18 89.7,123.99 93.98,128.27 R22.2
N$38
  Bottom 0.406: IC5.3 70.75,105.55 Q4.1 67.94,102.74 C27.2
N$39
  Bottom 0.406: Q3.2 98.93,30.48 | 98.93,30.48 98.93,30.61 97.16,32.38 IO2.1 | C12.1 98.93,30.48
N$40
  Bottom 0.406: IO2.2 95.89,32.38 94.11,30.61 Q3.1
N$41
  Bottom 0.406: IC6.7 135.89,106.68 136.53,107.31 136.53,109.86 137.79,111.12 SL6.14
N$42
  Bottom 0.406: IC5.2 74.78,104.75 Q4.2 73.03,102.74 C26.2
N$43
  Bottom 0.406: IC6.6 134.62,107.95 135.25,108.58 135.25,111.12 137.79,113.67 SL6.13
N$44
  Bottom 0.406: IC6.5 133.35,109.22 133.99,109.86 133.99,112.39 137.79,116.2 SL6.12
N$45  (1 unrouted)
N$46
  Bottom 0.406: IC6.4 132.08,110.49 132.72,111.12 132.72,113.67 137.79,118.75 SL6.11
N$47  (1 unrouted)
  Bottom 0.406: IC5.19 90.5,120.98 99.06,129.54 R23.2
N$48  (1 unrouted)
N$49  (2 unrouted)
N$50
  Bottom 0.406: IC7.15 116.84,93.98 117.47,94.61 117.47,95.89 118.11,96.52 135.89,96.52 137.79,94.61 137.79,90.81 139.06,89.53 SL3.4
N$51
  Bottom 0.406: IC7.1 134.62,95.25 136.53,93.34 136.53,88.27 137.79,87 SL3.5
N$52  (1 unrouted)
  Bottom 0.406: IC5.12 84.9,114.49 83.19,116.2 C29.+
N$53  (1 unrouted)
  Bottom 0.406: IC5.17 88.9,128.27 87.63,129.54 R32.2
N$54  (1 unrouted)
  Bottom 0.406: IC5.16 88.1,121.45 82.55,127 R31.2
N$55  (1 unrouted)
  Bottom 0.406: IC5.15 87.3,120.98 77.47,130.81 R30.2
N$56  (1 unrouted)
  Bottom 0.406: IC5.14 86.5,120.51 72.39,134.62 R29.2
N$57  (1 unrouted)
N$58  (1 unrouted)
N$59  (1 unrouted)
N$60  (1 unrouted)
N$61  (4 unrouted)
N$62  (1 unrouted)
N$63  (1 unrouted)
N$64  (1 unrouted)
N$65
  Bottom 0.406: IC6.3 130.81,111.76 131.44,112.39 131.44,114.94 137.79,121.28 SL6.10
N$66
  Bottom 0.406: IC6.2 129.54,113.03 130.18,113.67 130.18,116.2 137.79,123.83 SL6.9
N$67
  Bottom 0.406: IC6.1 128.27,114.3 128.91,114.94 128.91,117.47 137.79,126.36 SL6.8
N$68
  Bottom 0.406: IC6.15 116.84,113.03 132.72,128.91 SL6.7
N$71  (via drill 0.6)
  Top 0.406: v107.95,104.14 v107.95,111.76
  Bottom 0.406: IC5.32 106.7,104.75 107.31,104.14 v107.95,104.14 | v107.95,111.76 110.49,111.76 130.18,131.44 SL6.6
N$73  (via drill 0.6)
  Top 0.406: v105.41,102.87 v105.41,111.76
  Bottom 0.406: IC5.33 103.06,103.95 104.14,102.87 v105.41,102.87 | v105.41,111.76 130.18,136.53 SL6.4
N$76
  Bottom 0.406: IC7.14 114.3,92.71 113.67,93.34 113.67,104.78 114.3,105.41 IC6.9
N$78
  Bottom 0.406: IC7.2 133.35,93.98 135.25,92.08 135.25,85.72 136.53,84.45 SL3.6
N$79
  Bottom 0.406: IC7.3 132.08,92.71 133.99,90.81 133.99,83.19 135.25,81.92 SL3.7
N$80
  Bottom 0.406: IC7.4 130.81,91.44 132.72,89.53 132.72,80.64 133.99,79.38 SL3.8
N$82  (4 unrouted)
NRST  (3 unrouted)
OSC1KHZ_OUT  (5 unrouted)
RCK0
  Bottom 0.406: IC5.26 112.7,109.55 113.03,109.22 IC6.12
RCK1
  Bottom 0.406: IC5.31 109.08,105.55 110.49,104.14 110.49,91.44 111.76,90.17 IC7.12
SCK  (via drill 0.6)
  Top 0.406: v112.39,88.9 v112.39,107.95
  Bottom 0.406: IC6.11 v112.39,107.95 111.59,108.75 IC5.27 | IC7.11 v112.39,88.9
SCL  (via drill 0.6)
  Top 0.406: v111.12,87.63 v111.12,106.68
  Bottom 0.406: IC6.10 v111.12,106.68 110.8,106.35 IC5.30 | IC7.10 v111.12,87.63
SER
  Bottom 0.406: IC5.25 111.62,110.35 113.03,111.76 IC6.14
TL1  (3 unrouted)
TL2  (3 unrouted)
TL3  (3 unrouted)
TL4  (3 unrouted)
VDD  (30 unrouted)
  Bottom 0.406: IC7.16 115.67,96.62 116.84,97.79 137.16,97.79 137.79,97.16 SL3.1
ZERO_SENS  (1 unrouted)